# Altium schematic sheet OSSI-1 COMMS_1.SchDoc: TITLE:
size 410 x 287 mm; Date: Date:; >LAST_DATE_TIME: 01/11/2015 13:25:17; Sheet:: Sheet:; >SHEET: 2; REV:: REV:; Document Number:: Document Number:; >DRAWING_NAME: OSSI-1 COMMS.sch
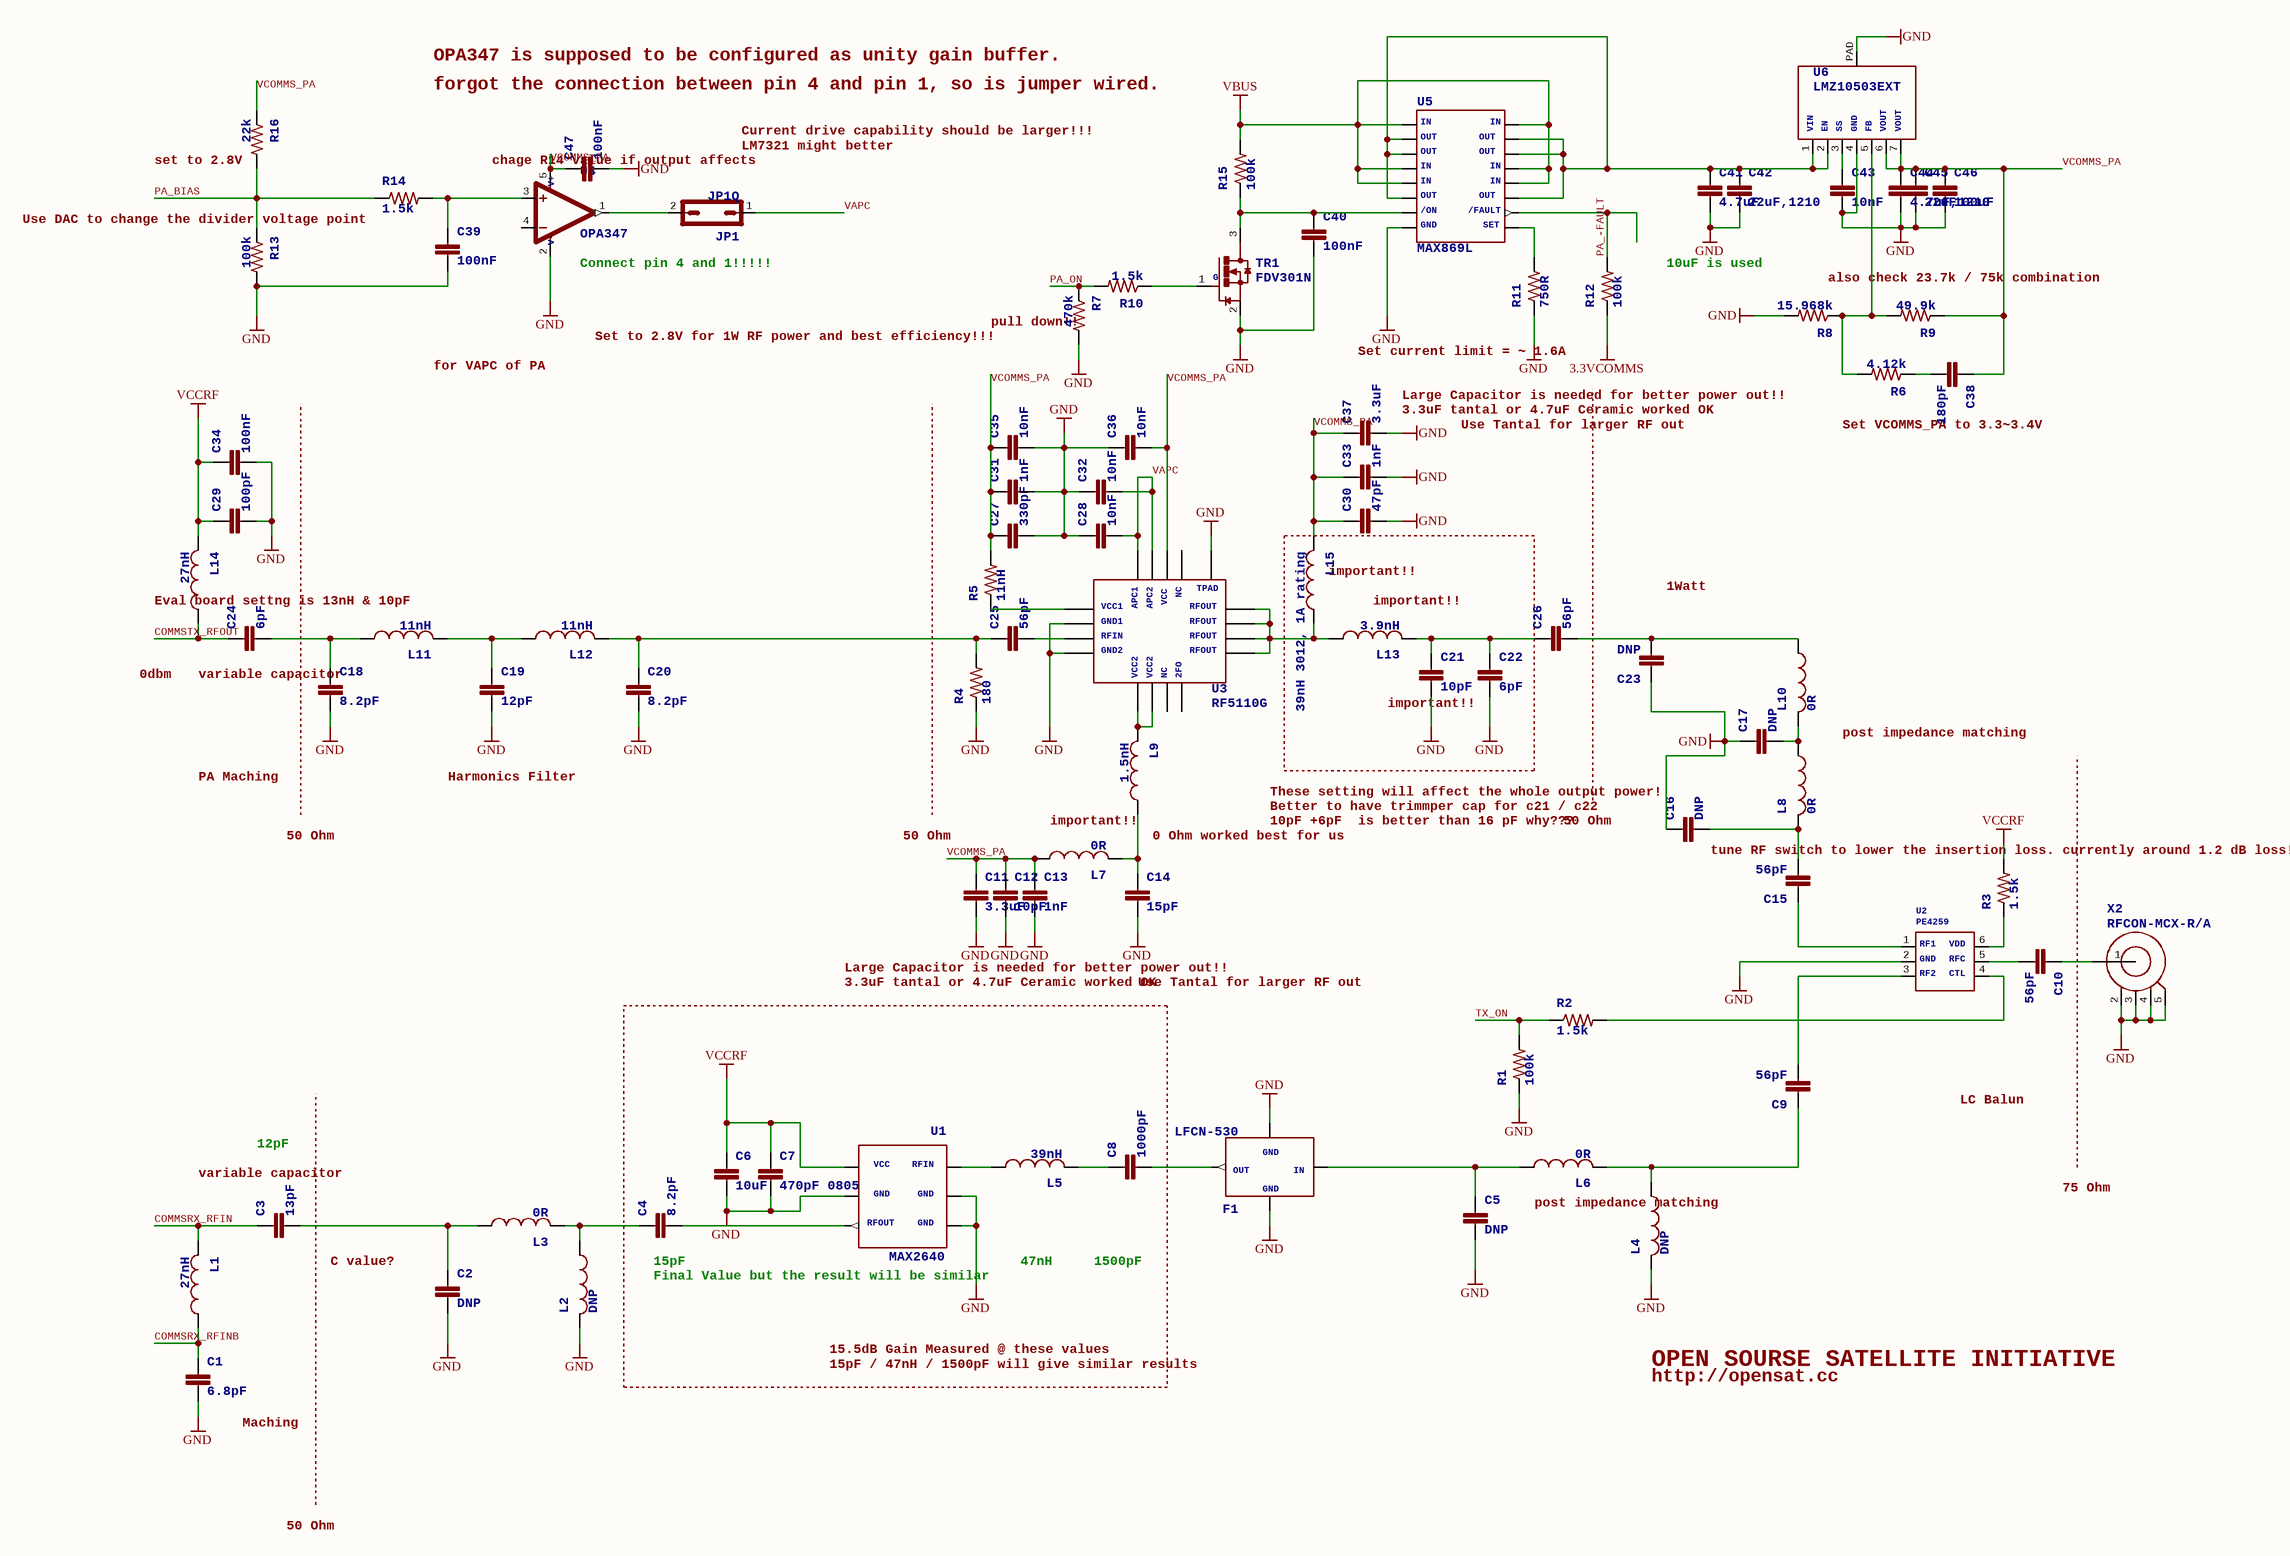
[diagram p0: OSSI-1 COMMS_1.SchDoc]

## Parts
C1  >NAME: C1  [C0603(1608)]  (hidden comment: 6.8pF)
C2  >NAME: C2  [C0603(1608)]  (hidden comment: DNP)
C3  >NAME: C3  [C0603(1608)]  (hidden comment: 13pF)
C4  >NAME: C4  [C0603(1608)]  (hidden comment: 8.2pF)
C5  >NAME: C5  [C0603(1608)]  (hidden comment: DNP)
C6  >NAME: C6  [C1206-GCM31]  (hidden comment: 10uF)
C7  >NAME: C7  [C0805(2012)]  (hidden comment: 470pF 0805)
C8  >NAME: C8  [C0603(1608)]  (hidden comment: 1000pF)
C9  >NAME: C9  [C0603(1608)]  (hidden comment: 56pF)
C10  >NAME: C10  [C0603(1608)]  (hidden comment: 56pF)
C11  >NAME: C11  [C1210-TMK325]  (hidden comment: 3.3uF)
C12  >NAME: C12  [C0603(1608)]  (hidden comment: 10pF)
C13  >NAME: C13  [C0603(1608)]  (hidden comment: 1nF)
C14  >NAME: C14  [C0603(1608)]  (hidden comment: 15pF)
C15  >NAME: C15  [C0603(1608)]  (hidden comment: 56pF)
C16  >NAME: C16  [C0603(1608)]  (hidden comment: DNP)
C17  >NAME: C17  [C0603(1608)]  (hidden comment: DNP)
C18  >NAME: C18  [C0603(1608)]  (hidden comment: 8.2pF)
C19  >NAME: C19  [C0603(1608)]  (hidden comment: 12pF)
C20  >NAME: C20  [C0603(1608)]  (hidden comment: 8.2pF)
C21  >NAME: C21  [C0603(1608)]  (hidden comment: 10pF)
C22  >NAME: C22  [C0603(1608)]  (hidden comment: 6pF)
C23  >NAME: C23  [C0603(1608)]  (hidden comment: DNP)
C24  >NAME: C24  [C0603(1608)]  (hidden comment: 6pF)
C25  >NAME: C25  [C0603(1608)]  (hidden comment: 56pF)
C26  >NAME: C26  [C0603(1608)]  (hidden comment: 56pF)
C27  >NAME: C27  [C0603(1608)]  (hidden comment: 330pF)
C28  >NAME: C28  [C0603(1608)]  (hidden comment: 10nF)
C29  >NAME: C29  [C0603(1608)]  (hidden comment: 100pF)
C30  >NAME: C30  [C0603(1608)]  (hidden comment: 47pF)
C31  >NAME: C31  [C0603(1608)]  (hidden comment: 1nF)
C32  >NAME: C32  [C0603(1608)]  (hidden comment: 10nF)
C33  >NAME: C33  [C0603(1608)]  (hidden comment: 1nF)
C34  >NAME: C34  [C0603(1608)]  (hidden comment: 100nF)
C35  >NAME: C35  [C0603(1608)]  (hidden comment: 10nF)
C36  >NAME: C36  [C0603(1608)]  (hidden comment: 10nF)
C37  >NAME: C37  [C1210-TMK325]  (hidden comment: 3.3uF)
C38  >NAME: C38  [C0603(1608)]  (hidden comment: 180pF)
C39  >NAME: C39  [C0603(1608)]  (hidden comment: 100nF)
C40  >NAME: C40  [C0603(1608)]  (hidden comment: 100nF)
C41  >NAME: C41  [C1210-GCM32]  (hidden comment: 4.7uF)
C42  >NAME: C42  [C1210-GCM32]  (hidden comment: 22uF,1210)
C43  >NAME: C43  [C0603(1608)]  (hidden comment: 10nF)
C44  >NAME: C44  [C0805(2012)]  (hidden comment: 4.7uF,1210)
C45  >NAME: C45  [C1210-GCM32]  (hidden comment: 22uF)
C46  >NAME: C46  [C1210-GCM32]  (hidden comment: 100uF)
C47  >NAME: C47  [C0603(1608)]  (hidden comment: 100nF)
F1  >NAME: F1  [LFCN]  (hidden comment: LFCN-530)
JP1  JP1Q  [JP1]
L1  >NAME: L1  [L0603(1608)]  (hidden comment: 27nH)
L2  >NAME: L2  [L0603(1608)]  (hidden comment: DNP)
L3  >NAME: L3  [L0603(1608)]  (hidden comment: 0R)
L4  >NAME: L4  [L0603(1608)]  (hidden comment: DNP)
L5  >NAME: L5  [L0603(1608)]  (hidden comment: 39nH)
L6  >NAME: L6  [L0603(1608)]  (hidden comment: 0R)
L7  >NAME: L7  [LQH32CN331K23L]  (hidden comment: 0R)
L8  >NAME: L8  [L0603(1608)]  (hidden comment: 0R)
L9  >NAME: L9  [L0603(1608)]  (hidden comment: 1.5nH)
L10  >NAME: L10  [L0603(1608)]  (hidden comment: 0R)
L11  >NAME: L11  [L0603(1608)]  (hidden comment: 11nH)
L12  >NAME: L12  [L0603(1608)]  (hidden comment: 11nH)
L13  >NAME: L13  [L0603(1608)]  (hidden comment: 3.9nH)
L14  >NAME: L14  [L0603(1608)]  (hidden comment: 27nH)
L15  >NAME: L15  [NR3012]  (hidden comment: 39nH 3012, 1A rating)
R1  >NAME: R1  [R0603(1608)]  (hidden comment: 100k)
R2  >NAME: R2  [R0603(1608)]  (hidden comment: 1.5k)
R3  >NAME: R3  [R0603(1608)]  (hidden comment: 1.5k)
R4  >NAME: R4  [R0603(1608)]  (hidden comment: 180)
R5  >NAME: R5  [R0603(1608)]  (hidden comment: 11nH)
R6  >NAME: R6  [R0603(1608)]  (hidden comment: 4.12k)
R7  >NAME: R7  [R0603(1608)]  (hidden comment: 470k)
R8  >NAME: R8  [R0603(1608)]  (hidden comment: 15.968k)
R9  >NAME: R9  [R0603(1608)]  (hidden comment: 49.9k)
R10  >NAME: R10  [R0603(1608)]  (hidden comment: 1.5k)
R11  >NAME: R11  [R0603(1608)]  (hidden comment: 750R)
R12  >NAME: R12  [R0603(1608)]  (hidden comment: 100k)
R13  >NAME: R13  [R0603(1608)]  (hidden comment: 100k)
R14  >NAME: R14  [R0603(1608)]  (hidden comment: 1.5k)
R15  >NAME: R15  [R0603(1608)]  (hidden comment: 100k)
R16  >NAME: R16  [R0603(1608)]  (hidden comment: 22k)
TR1  >NAME: TR1  [SOT23]  (hidden comment: FDV301N)
U1  >NAME: U1  [SOT23-6]  (hidden comment: MAX2640)
U2  >NAME: U2  [SC70-6]  (hidden comment: PE4259)
U3  >NAME: U3  [RF5110G]  (hidden comment: RF5110G)
U4  >NAME: U4  [SOT23-5DBV]  (hidden comment: OPA347)
U5  >NAME: U5  [16QSOP]  (hidden comment: MAX869L)
U6  >NAME: U6  [TO-PMOD-7]  (hidden comment: LMZ10503EXT)
X2  >NAME: X2  [MCX-R/A]  (hidden comment: RFCON-MCX-R/A)

## Nets
3.3VCOMMS: R12.1
GND: C1.2 C2.2 C5.2 C6.P$2 C7.2 C11.P$2 C12.2 C13.2 C14.2 C16.1 C17.1 C18.2 C19.2 C20.2 C21.2 C22.2 C23.1 C27.2 C28.1 C29.2 C30.2 C31.2 C32.1 C33.2 C34.2 C35.2 C36.1 C37.P$2 C39.2 C40.2 C41.P$2 C42.P$2 C43.2 C44.2 C45.P$2 C46.P$2 C47.2 F1.2(P$2) F1.4(P$4) L2.2 L4.2 R1.1 R4.1 R7.2 R8.2 R11.1 R13.2 TR1.2(S) U1.2 U1.3 U1.5 U2.2(P$2) U3.2(P$2) U3.4(P$4) U3.TPAD(P$17) U4.2(V-) U5.8(P$8) U6.4(P$4) U6.PAD(P$8) X2.2 X2.3 X2.4 X2.5
VBUS: R15.2 U5.1(P$1) U5.4(P$4) U5.5(P$5) U5.12(P$12) U5.13(P$13) U5.16(P$16)
VCCRF: C6.P$1 C7.1 C29.1 C34.1 L14.2 R3.2 U1.6
COMMSRX_RFIN: C3.1 L1.2
COMMSRX_RFINB: C1.1 L1.1
COMMSTX_RFOUT: C24.1 L14.1
PA_-FAULT: R12.2 U5.10(P$10)
PA_BIAS: R13.1 R14.1 R16.2
PA_ON: R7.1 R10.2
TX_ON: R1.2 R2.1
VAPC: C28.2 C32.2 JP1.1 U3.15(P$15) U3.16(P$16)
VCOMMS_PA: C11.P$1 C12.1 C13.1 C27.1 C30.1 C31.1 C33.1 C35.1 C36.2 C37.P$1 C38.1 C44.1 C45.P$1 C46.P$1 C47.1 L7.P$1 L15.P$2 R5.2 R9.1 R16.1 U3.14(P$14) U4.5(V+) U6.6(P$6) U6.7(P$7)
NetC2_1: C2.1 C3.2 L3.1
NetC4_1: C4.1 L2.1 L3.2
NetC4_2: C4.2 U1.4
NetC5_1: C5.1 F1.1(P$1) L6.1
NetC8_1: C8.1 L5.2
NetC8_2: C8.2 F1.3(P$3)
NetC9_1: C9.1 L4.1 L6.2
NetC9_2: C9.2 U2.3(P$3)
NetC10_1: C10.1 X2.1
NetC10_2: C10.2 U2.5(P$5)
NetC14_1: C14.1 L7.P$2 L9.1
NetC15_1: C15.1 U2.1(P$1)
NetC15_2: C15.2 C16.2 L8.2
NetC17_2: C17.2 L8.1 L10.2
NetC18_1: C18.1 C24.2 L11.1
NetC19_1: C19.1 L11.2 L12.1
NetC20_1: C20.1 C25.1 L12.2 R4.2
NetC21_1: C21.1 C22.1 C26.1 L13.2
NetC23_2: C23.2 C26.2 L10.1
NetC25_2: C25.2 U3.3(P$3)
NetC38_2: C38.2 R6.1
NetC39_1: C39.1 R14.2 U4.3(+IN)
NetC40_1: C40.1 R15.1 TR1.3(D) U5.7(P$7)
NetC41_P$1: C41.P$1 C42.P$1 U5.2(P$2) U5.3(P$3) U5.6(P$6) U5.11(P$11) U5.14(P$14) U5.15(P$15) U6.1(P$1) U6.2(P$2)
NetC43_1: C43.1 U6.3(P$3)
NetJP1_2: JP1.2 U4.1(OUT)
NetL5_1: L5.1 U1.1
NetL9_2: L9.2 U3.5(P$5) U3.6(P$6)
NetL13_1: L13.1 L15.P$1 U3.9(P$9) U3.10(P$10) U3.11(P$11) U3.12(P$12)
NetR2_2: R2.2 U2.4(P$4)
NetR3_1: R3.1 U2.6(P$6)
NetR5_1: R5.1 U3.1(P$1)
NetR6_2: R6.2 R8.1 R9.2 U6.5(P$5)
NetR10_1: R10.1 TR1.1(G)
NetR11_2: R11.2 U5.9(P$9)

Not connected (* = marked no-connect by the designer): U3 7(P$7) 8(P$8) 13(P$13); U4 4(-IN)

## Notes on the sheet
- OPA347 is supposed to be configured as unity gain buffer.
- forgot the connection between pin 4 and pin 1, so is jumper wired.
- Current drive capability should be larger!!!
- LM7321 might better
- (near R13) Use DAC to change the divider voltage point
- (near R16) set to 2.8V
- (near C47) chage R14 value if output affects
- (near U4) Connect pin 4 and 1!!!!!
- 10uF is used
- also check 23.7k / 75k combination
- for VAPC of PA
- Set to 2.8V for 1W RF power and best efficiency!!!
- (near R7) pull down!!
- (near R11) Set current limit = ~ 1.6A
- (near C37) 3.3uF tantal or 4.7uF Ceramic worked OK
- (near C37) Large Capacitor is needed for better power out!!
- Use Tantal for larger RF out
- Set VCOMMS_PA to 3.3~3.4V
- (near L15) important!!
- 1Watt
- (near L14) Eval board settng is 13nH & 10pF
- (near L13) important!!
- 0dbm
- (near C18) variable capacitor
- (near C21) important!!
- post impedance matching
- PA Maching
- Harmonics Filter
- These setting will affect the whole output power!
- Better to have trimmper cap for c21 / c22
- 50 Ohm
- important!!
- 0 Ohm worked best for us
- 10pF +6pF  is better than 16 pF why???
- tune RF switch to lower the insertion loss. currently around 1.2 dB loss!!!!
- 3.3uF tantal or 4.7uF Ceramic worked OK
- Large Capacitor is needed for better power out!!
- LC Balun
- (near C3) variable capacitor
- 12pF
- (near L4) post impedance matching
- 75 Ohm
- C value?
- (near C4) 15pF
- Final Value but the result will be similar
- 47nH
- 1500pF
- 15.5dB Gain Measured @ these values
- 15pF / 47nH / 1500pF will give similar results
- OPEN SOURSE SATELLITE INITIATIVE
- http://opensat.cc
- (near C1) Maching

## Library data of the parts
C1-C5 C8-C10 C12-C36 C38-C40 C43 C47 = C0603(1608)
  C1: >VALUE: 6.8pF
  C2 C5 C16 C17 C23: >VALUE: DNP
  C3: >VALUE: 13pF
  C4 C18 C20: >VALUE: 8.2pF
  C8: >VALUE: 1000pF
  C9 C10 C15 C25 C26: >VALUE: 56pF
  C12 C21: >VALUE: 10pF
  C13 C31 C33: >VALUE: 1nF
  C14: >VALUE: 15pF
  C19: >VALUE: 12pF
  C22 C24: >VALUE: 6pF
  C27: >VALUE: 330pF
  C28 C32 C35 C36 C43: >VALUE: 10nF
  C29: >VALUE: 100pF
  C30: >VALUE: 47pF
  C34 C39 C40 C47: >VALUE: 100nF
  C38: >VALUE: 180pF
C6 = C1206(3216)-GCM31: >VALUE: 10uF
C7 C44 = C0805(2012)
  C7: >VALUE: 470pF 0805
  C44: >VALUE: 4.7uF,1210
C11 C37 = C1210(3225)-TMK325: >VALUE: 3.3uF
C41 C42 C45 C46 = C1210(3225)-GCM32
  C41: >VALUE: 4.7uF
  C42: >VALUE: 22uF,1210
  C45: >VALUE: 22uF
  C46: >VALUE: 100uF
F1 = LFCN-160: <b>LFCN-160 Low Pass Filter</b> / <ul> / <li>DC - 160MHz Low Pass Filter</li> / <li>Cut Off Freq: 230MHz</li> / <li>8W power rating ( degraded to 3W at 100 celcius degree)</li> / </ul>; IN: IN; OUT: OUT; GND: GND; >VALUE: LFCN-530
JP1 = JP1Q: <b>JUMPER</b>; >NAME: JP1; >VALUE: JP1Q
L1-L6 L8-L14 = L0603(1608)
  L1 L14: >VALUE: 27nH
  L2 L4: >VALUE: DNP
  L3 L6 L8 L10: >VALUE: 0R
  L5: >VALUE: 39nH
  L9: >VALUE: 1.5nH
  L11 L12: >VALUE: 11nH
  L13: >VALUE: 3.9nH
L7 = LLQH32CN: >VALUE: 0R
L15 = LNR3012: >VALUE: 39nH 3012, 1A rating
R1-R16 = R0603(1608)
  R1 R12 R13 R15: >VALUE: 100k
  R2 R3 R10 R14: >VALUE: 1.5k
  R4: >VALUE: 180
  R5: >VALUE: 11nH
  R6: >VALUE: 4.12k
  R7: >VALUE: 470k
  R8: >VALUE: 15.968k
  R9: >VALUE: 49.9k
  R11: >VALUE: 750R
  R16: >VALUE: 22k
TR1 = FDV301N: FDV301N Digital N channel - FET / Rdson = 5 Ohm / Vgs = 0.7~1.06V / Ids = 220mA; G: G; >VALUE: FDV301N
U1 = MAX2640: <b>MAX2640 </b> / <ul> / <li>ultra-low-noise amplifiers</li> / <li>operating frequency: 300MHz to 2500MHz </li> / <li>+2.7V to +5.5V Single-Supply Operation  </li> / <li>Low 3.5mA Supply Current </li> / </ul>; RFIN: RFIN; GND: GND; RFOUT: RFOUT; VCC: VCC; >VALUE: MAX2640
U3 = RF5110G: <b>RF5110G</b> / <br /> / 3V GSM RF Power Amplifirer / <br /> / +36dBm Output Power at 3.5V; VCC1: VCC1; GND1: GND1; RFIN: RFIN; GND2: GND2; VCC2: VCC2; NC: NC; 2FO: 2FO; RFOUT: RFOUT; VCC: VCC; APC2: APC2; APC1: APC1; >VALUE: RF5110G; TPAD: TPAD
U4 = OPA347: <b>OPA347</b> / <ul> / <li>RAIL-TO-RAIL INPUT AND OUTPUT</li> / <li>SINGLE SUPPLY: 2.3V to 5.5V</li> / <li>LOW IQ: 20µ</li> / </ul>; >VALUE: OPA347; V+: V+; V-: V-
U5 = MAX869L: 2A, Current-Limited, High-Side / P-Channel Switch with Thermal Shutdown; IN: IN; OUT: OUT; GND: GND; /ON: /ON; /FAULT: /FAULT; SET: SET; >VALUE: MAX869L
U6 = LMZ10503EXT: LMZ10503EXT / June 14, 2011 / 3A SIMPLE SWITCHER® Power Module with 5.5V Maximum / Input Voltage for Military and Rugged Applications; VIN: VIN; EN: EN; SS: SS; GND: GND; FB: FB; VOUT: VOUT; >VALUE: LMZ10503EXT
X2 = RFCON-MCX-R/A: RF Connectors; >VALUE: RFCON-MCX-R/A
U2 = PE4259: RF1: RF1; GND: GND; RF2: RF2; CTL: CTL; RFC: RFC; VDD: VDD; >VALUE: PE4259